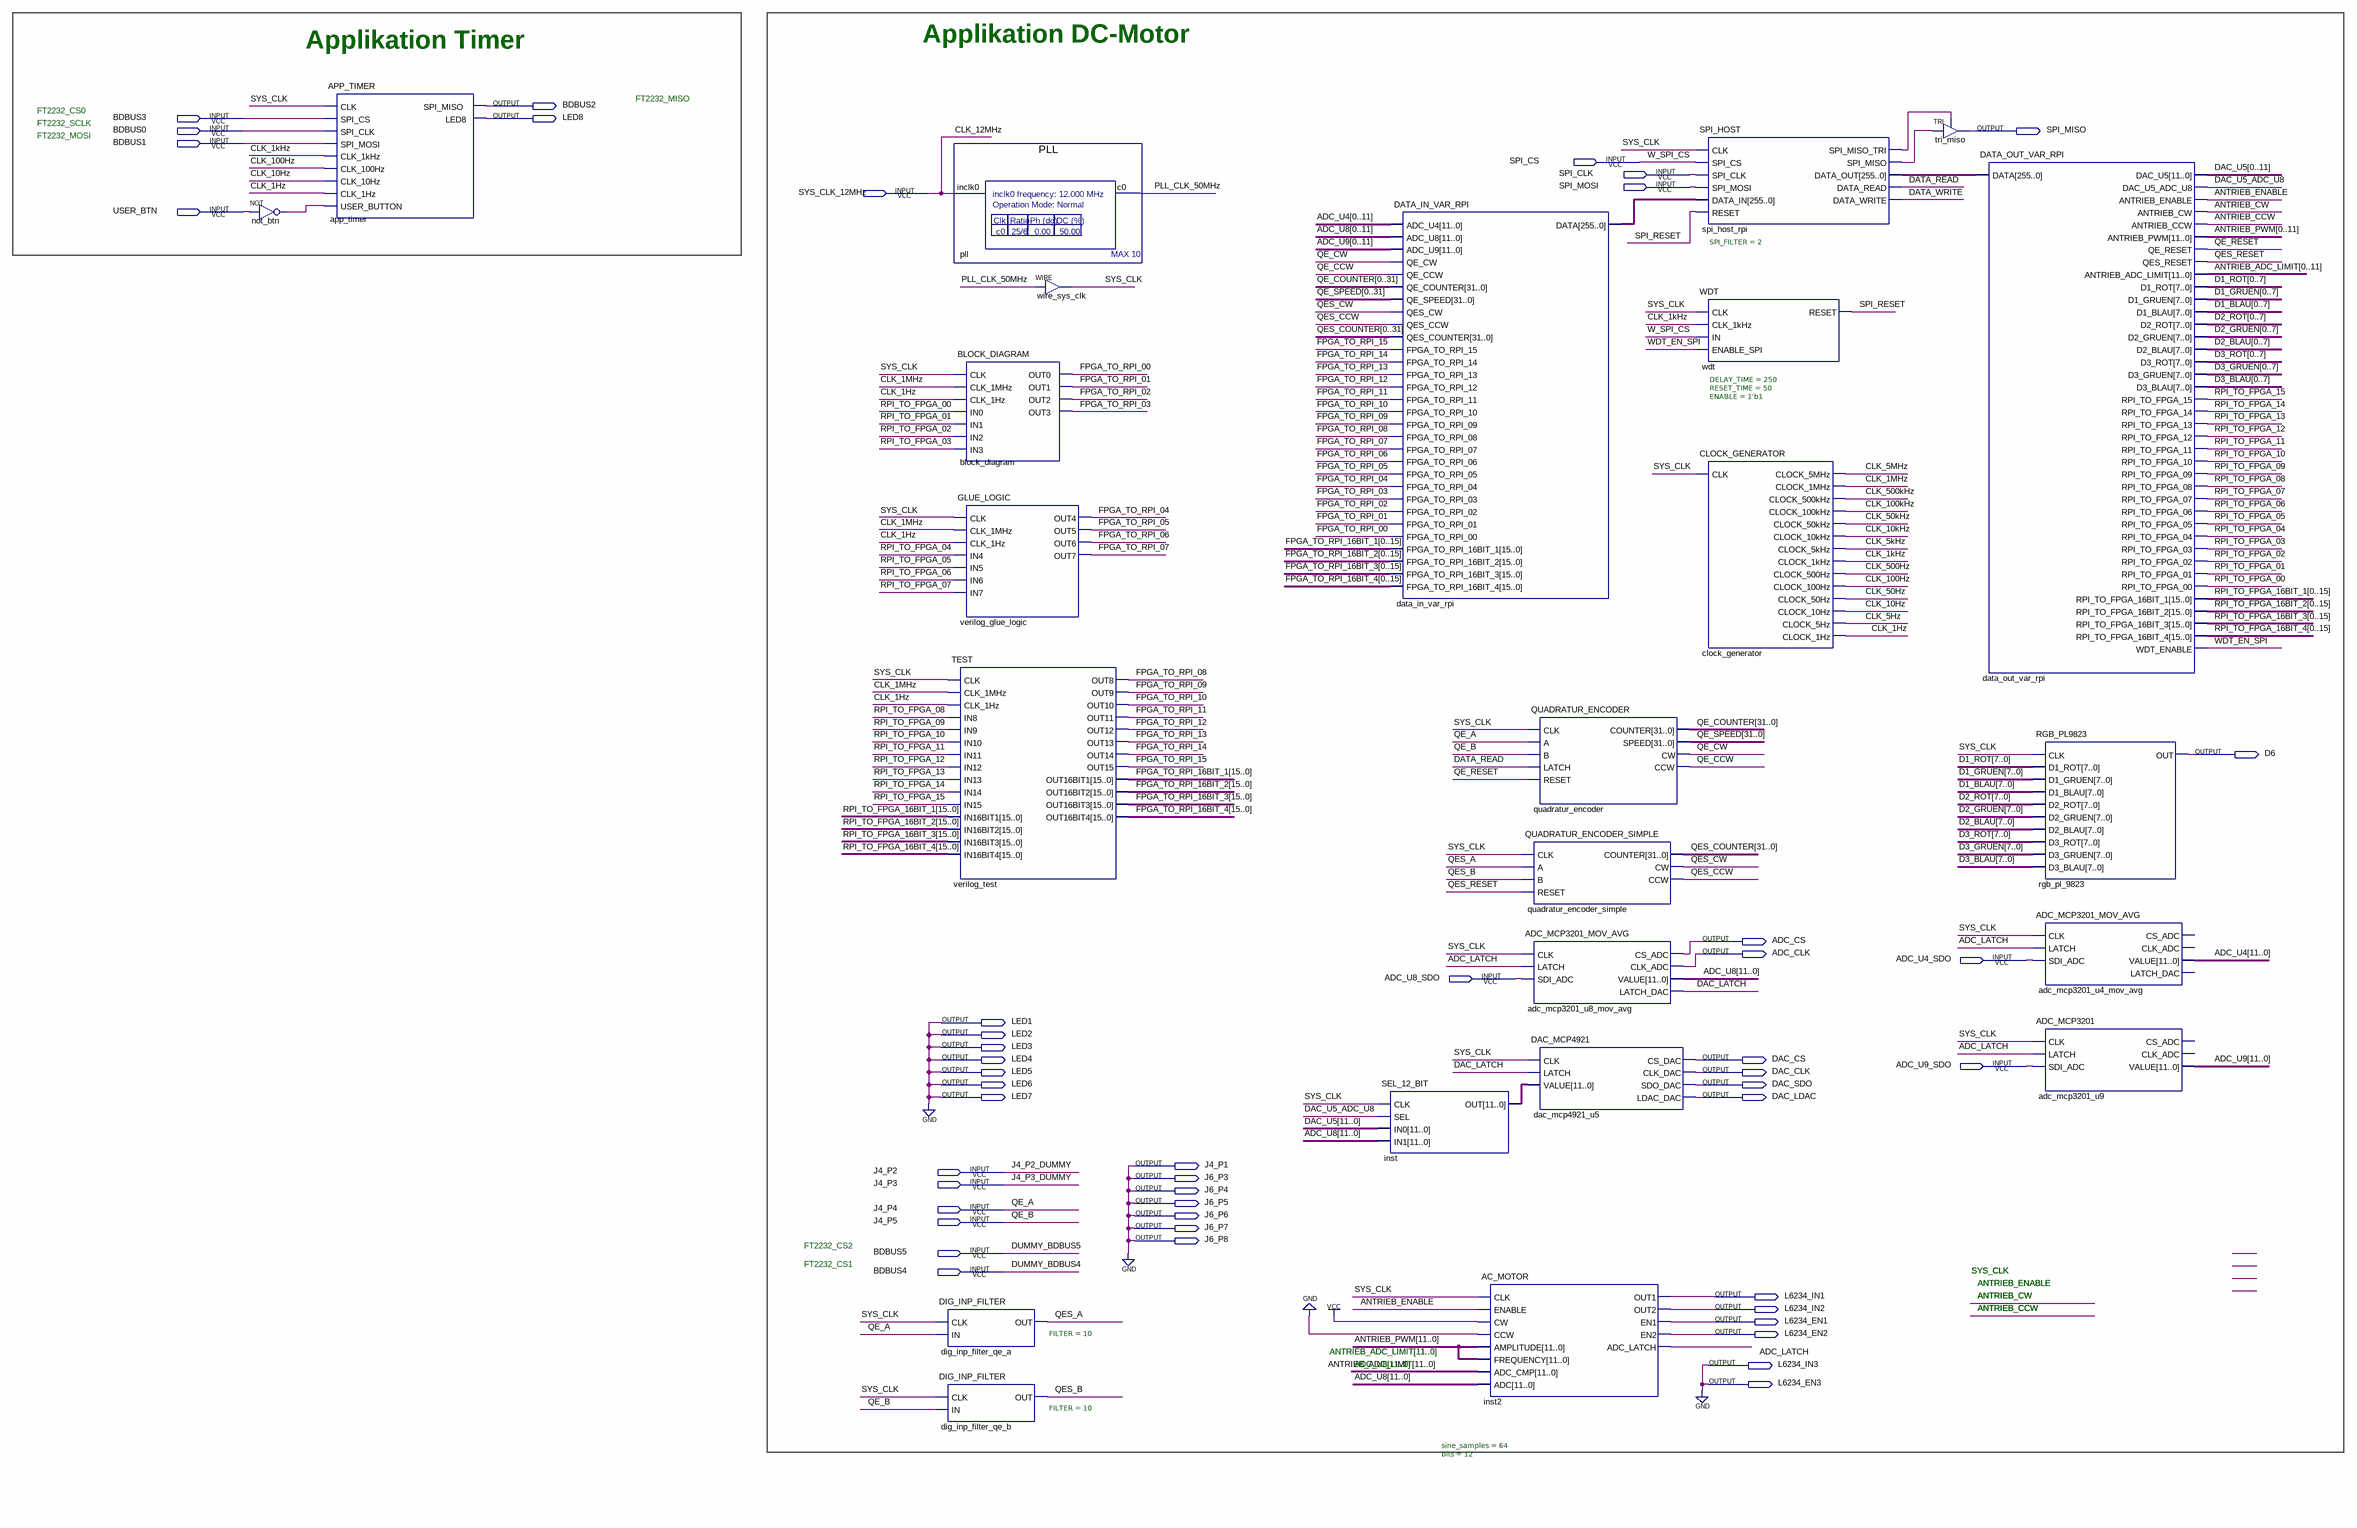
[diagram p0: schematic sheet]
// Quartus schematic MAX1000.bdf as structural Verilog: 24 symbols, 47 pins
module MAX1000 (
  input  BDBUS3,
  input  BDBUS0,
  input  BDBUS1,
  input  SPI_CS,
  input  SPI_CLK,
  input  SPI_MOSI,
  input  SYS_CLK_12MHz,
  input  USER_BTN,
  input  ADC_U4_SDO,
  input  ADC_U8_SDO,
  input  ADC_U9_SDO,
  input  J4_P2,
  input  J4_P3,
  input  J4_P4,
  input  J4_P5,
  input  BDBUS5,
  input  BDBUS4,
  output BDBUS2,
  output LED8,
  output SPI_MISO,
  output D6,
  output ADC_CS,
  output ADC_CLK,
  output LED1,
  output LED2,
  output LED3,
  output LED4,
  output DAC_CS,
  output LED5,
  output DAC_CLK,
  output LED6,
  output DAC_SDO,
  output LED7,
  output DAC_LDAC,
  output J4_P1,
  output J6_P3,
  output J6_P4,
  output J6_P5,
  output J6_P6,
  output J6_P7,
  output J6_P8,
  output L6234_IN1,
  output L6234_IN2,
  output L6234_EN1,
  output L6234_EN2,
  output L6234_IN3,
  output L6234_EN3
);

  wire ADC_LATCH, ANTRIEB_CCW, ANTRIEB_CW, ANTRIEB_ENABLE, CLK_1Hz, CLK_1kHz, CLK_1MHz, CLK_5Hz, CLK_5kHz,
       CLK_5MHz, CLK_10Hz, CLK_10kHz, CLK_50Hz, CLK_50kHz, CLK_100Hz, CLK_100kHz, CLK_500Hz, CLK_500kHz,
       DAC_LATCH, DAC_U5_ADC_U8, DATA_READ, DATA_WRITE, FPGA_TO_RPI_00, FPGA_TO_RPI_01, FPGA_TO_RPI_02,
       FPGA_TO_RPI_03, FPGA_TO_RPI_04, FPGA_TO_RPI_05, FPGA_TO_RPI_06, FPGA_TO_RPI_07, FPGA_TO_RPI_08,
       FPGA_TO_RPI_09, FPGA_TO_RPI_10, FPGA_TO_RPI_11, FPGA_TO_RPI_12, FPGA_TO_RPI_13, FPGA_TO_RPI_14,
       FPGA_TO_RPI_15, not_btn_out, PLL_CLK_50MHz, QE_CCW, QE_CW, QE_RESET, QES_A, QES_B, QES_CCW, QES_CW,
       QES_RESET, RPI_TO_FPGA_00, RPI_TO_FPGA_01, RPI_TO_FPGA_02, RPI_TO_FPGA_03, RPI_TO_FPGA_04,
       RPI_TO_FPGA_05, RPI_TO_FPGA_06, RPI_TO_FPGA_07, RPI_TO_FPGA_08, RPI_TO_FPGA_09, RPI_TO_FPGA_10,
       RPI_TO_FPGA_11, RPI_TO_FPGA_12, RPI_TO_FPGA_13, RPI_TO_FPGA_14, RPI_TO_FPGA_15, spi_host_rpi_spi_miso,
       spi_host_rpi_spi_miso_tri, SPI_RESET, SYS_CLK, WDT_EN_SPI;
  wire [7:0] D1_BLAU, D1_GRUEN, D1_ROT, D2_BLAU, D2_GRUEN, D2_ROT, D3_BLAU, D3_GRUEN, D3_ROT;
  wire [11:0] ADC_U4, ADC_U8, ADC_U9, ANTRIEB_ADC_LIMIT, ANTRIEB_PWM, DAC_U5, inst_out;
  wire [15:0] FPGA_TO_RPI_16BIT_1, FPGA_TO_RPI_16BIT_2, FPGA_TO_RPI_16BIT_3, FPGA_TO_RPI_16BIT_4,
       RPI_TO_FPGA_16BIT_1, RPI_TO_FPGA_16BIT_2, RPI_TO_FPGA_16BIT_3, RPI_TO_FPGA_16BIT_4;
  wire [31:0] QE_COUNTER, QE_SPEED, QES_COUNTER;
  wire [255:0] data_in_var_rpi_data, spi_host_rpi_data_out;

  not not_btn (not_btn_out, USER_BTN);
  APP_TIMER app_timer (
    .CLK(SYS_CLK), .SPI_CS(BDBUS3), .SPI_CLK(BDBUS0), .SPI_MOSI(BDBUS1), .CLK_1kHz(CLK_1kHz),
    .CLK_100Hz(CLK_100Hz), .CLK_10Hz(CLK_10Hz), .CLK_1Hz(CLK_1Hz), .USER_BUTTON(not_btn_out),
    .SPI_MISO(BDBUS2), .LED8(LED8));
  PLL pll (.inclk0(SYS_CLK_12MHz), .c0(PLL_CLK_50MHz));
  BLOCK_DIAGRAM block_diagram (
    .CLK(SYS_CLK), .CLK_1MHz(CLK_1MHz), .CLK_1Hz(CLK_1Hz), .IN0(RPI_TO_FPGA_00), .IN1(RPI_TO_FPGA_01),
    .IN2(RPI_TO_FPGA_02), .IN3(RPI_TO_FPGA_03), .OUT0(FPGA_TO_RPI_00), .OUT1(FPGA_TO_RPI_01),
    .OUT2(FPGA_TO_RPI_02), .OUT3(FPGA_TO_RPI_03));
  GLUE_LOGIC verilog_glue_logic (
    .CLK(SYS_CLK), .CLK_1MHz(CLK_1MHz), .CLK_1Hz(CLK_1Hz), .IN4(RPI_TO_FPGA_04), .IN5(RPI_TO_FPGA_05),
    .IN6(RPI_TO_FPGA_06), .IN7(RPI_TO_FPGA_07), .OUT4(FPGA_TO_RPI_04), .OUT5(FPGA_TO_RPI_05),
    .OUT6(FPGA_TO_RPI_06), .OUT7(FPGA_TO_RPI_07));
  TEST verilog_test (
    .CLK(SYS_CLK), .CLK_1MHz(CLK_1MHz), .CLK_1Hz(CLK_1Hz), .IN8(RPI_TO_FPGA_08), .IN9(RPI_TO_FPGA_09),
    .IN10(RPI_TO_FPGA_10), .IN11(RPI_TO_FPGA_11), .IN12(RPI_TO_FPGA_12), .IN13(RPI_TO_FPGA_13),
    .IN14(RPI_TO_FPGA_14), .IN15(RPI_TO_FPGA_15), .IN16BIT1(RPI_TO_FPGA_16BIT_1),
    .IN16BIT2(RPI_TO_FPGA_16BIT_2), .IN16BIT3(RPI_TO_FPGA_16BIT_3), .IN16BIT4(RPI_TO_FPGA_16BIT_4),
    .OUT8(FPGA_TO_RPI_08), .OUT9(FPGA_TO_RPI_09), .OUT10(FPGA_TO_RPI_10), .OUT11(FPGA_TO_RPI_11),
    .OUT12(FPGA_TO_RPI_12), .OUT13(FPGA_TO_RPI_13), .OUT14(FPGA_TO_RPI_14), .OUT15(FPGA_TO_RPI_15),
    .OUT16BIT1(FPGA_TO_RPI_16BIT_1), .OUT16BIT2(FPGA_TO_RPI_16BIT_2), .OUT16BIT3(FPGA_TO_RPI_16BIT_3),
    .OUT16BIT4(FPGA_TO_RPI_16BIT_4));
  DIG_INP_FILTER #(.FILTER(10)) dig_inp_filter_qe_a (.CLK(SYS_CLK), .IN(J4_P4), .OUT(QES_A));
  DIG_INP_FILTER #(.FILTER(10)) dig_inp_filter_qe_b (.CLK(SYS_CLK), .IN(J4_P5), .OUT(QES_B));
  assign SYS_CLK = PLL_CLK_50MHz;  // WIRE wire_sys_clk
  DATA_IN_VAR_RPI data_in_var_rpi (
    .ADC_U4({ADC_U4[0], ADC_U4[1], ADC_U4[2], ADC_U4[3], ADC_U4[4], ADC_U4[5], ADC_U4[6], ADC_U4[7], ADC_U4[8], ADC_U4[9], ADC_U4[10], ADC_U4[11]}),
    .ADC_U8({ADC_U8[0], ADC_U8[1], ADC_U8[2], ADC_U8[3], ADC_U8[4], ADC_U8[5], ADC_U8[6], ADC_U8[7], ADC_U8[8], ADC_U8[9], ADC_U8[10], ADC_U8[11]}),
    .ADC_U9({ADC_U9[0], ADC_U9[1], ADC_U9[2], ADC_U9[3], ADC_U9[4], ADC_U9[5], ADC_U9[6], ADC_U9[7], ADC_U9[8], ADC_U9[9], ADC_U9[10], ADC_U9[11]}),
    .QE_CW(QE_CW), .QE_CCW(QE_CCW),
    .QE_COUNTER({QE_COUNTER[0], QE_COUNTER[1], QE_COUNTER[2], QE_COUNTER[3], QE_COUNTER[4], QE_COUNTER[5], QE_COUNTER[6], QE_COUNTER[7], QE_COUNTER[8], QE_COUNTER[9], QE_COUNTER[10], QE_COUNTER[11], QE_COUNTER[12], QE_COUNTER[13], QE_COUNTER[14], QE_COUNTER[15], QE_COUNTER[16], QE_COUNTER[17], QE_COUNTER[18], QE_COUNTER[19], QE_COUNTER[20], QE_COUNTER[21], QE_COUNTER[22], QE_COUNTER[23], QE_COUNTER[24], QE_COUNTER[25], QE_COUNTER[26], QE_COUNTER[27], QE_COUNTER[28], QE_COUNTER[29], QE_COUNTER[30], QE_COUNTER[31]}),
    .QE_SPEED({QE_SPEED[0], QE_SPEED[1], QE_SPEED[2], QE_SPEED[3], QE_SPEED[4], QE_SPEED[5], QE_SPEED[6], QE_SPEED[7], QE_SPEED[8], QE_SPEED[9], QE_SPEED[10], QE_SPEED[11], QE_SPEED[12], QE_SPEED[13], QE_SPEED[14], QE_SPEED[15], QE_SPEED[16], QE_SPEED[17], QE_SPEED[18], QE_SPEED[19], QE_SPEED[20], QE_SPEED[21], QE_SPEED[22], QE_SPEED[23], QE_SPEED[24], QE_SPEED[25], QE_SPEED[26], QE_SPEED[27], QE_SPEED[28], QE_SPEED[29], QE_SPEED[30], QE_SPEED[31]}),
    .QES_CW(QES_CW), .QES_CCW(QES_CCW),
    .QES_COUNTER({QES_COUNTER[0], QES_COUNTER[1], QES_COUNTER[2], QES_COUNTER[3], QES_COUNTER[4], QES_COUNTER[5], QES_COUNTER[6], QES_COUNTER[7], QES_COUNTER[8], QES_COUNTER[9], QES_COUNTER[10], QES_COUNTER[11], QES_COUNTER[12], QES_COUNTER[13], QES_COUNTER[14], QES_COUNTER[15], QES_COUNTER[16], QES_COUNTER[17], QES_COUNTER[18], QES_COUNTER[19], QES_COUNTER[20], QES_COUNTER[21], QES_COUNTER[22], QES_COUNTER[23], QES_COUNTER[24], QES_COUNTER[25], QES_COUNTER[26], QES_COUNTER[27], QES_COUNTER[28], QES_COUNTER[29], QES_COUNTER[30], QES_COUNTER[31]}),
    .FPGA_TO_RPI_15(FPGA_TO_RPI_15), .FPGA_TO_RPI_14(FPGA_TO_RPI_14), .FPGA_TO_RPI_13(FPGA_TO_RPI_13),
    .FPGA_TO_RPI_12(FPGA_TO_RPI_12), .FPGA_TO_RPI_11(FPGA_TO_RPI_11), .FPGA_TO_RPI_10(FPGA_TO_RPI_10),
    .FPGA_TO_RPI_09(FPGA_TO_RPI_09), .FPGA_TO_RPI_08(FPGA_TO_RPI_08), .FPGA_TO_RPI_07(FPGA_TO_RPI_07),
    .FPGA_TO_RPI_06(FPGA_TO_RPI_06), .FPGA_TO_RPI_05(FPGA_TO_RPI_05), .FPGA_TO_RPI_04(FPGA_TO_RPI_04),
    .FPGA_TO_RPI_03(FPGA_TO_RPI_03), .FPGA_TO_RPI_02(FPGA_TO_RPI_02), .FPGA_TO_RPI_01(FPGA_TO_RPI_01),
    .FPGA_TO_RPI_00(FPGA_TO_RPI_00),
    .FPGA_TO_RPI_16BIT_1({FPGA_TO_RPI_16BIT_1[0], FPGA_TO_RPI_16BIT_1[1], FPGA_TO_RPI_16BIT_1[2], FPGA_TO_RPI_16BIT_1[3], FPGA_TO_RPI_16BIT_1[4], FPGA_TO_RPI_16BIT_1[5], FPGA_TO_RPI_16BIT_1[6], FPGA_TO_RPI_16BIT_1[7], FPGA_TO_RPI_16BIT_1[8], FPGA_TO_RPI_16BIT_1[9], FPGA_TO_RPI_16BIT_1[10], FPGA_TO_RPI_16BIT_1[11], FPGA_TO_RPI_16BIT_1[12], FPGA_TO_RPI_16BIT_1[13], FPGA_TO_RPI_16BIT_1[14], FPGA_TO_RPI_16BIT_1[15]}),
    .FPGA_TO_RPI_16BIT_2({FPGA_TO_RPI_16BIT_2[0], FPGA_TO_RPI_16BIT_2[1], FPGA_TO_RPI_16BIT_2[2], FPGA_TO_RPI_16BIT_2[3], FPGA_TO_RPI_16BIT_2[4], FPGA_TO_RPI_16BIT_2[5], FPGA_TO_RPI_16BIT_2[6], FPGA_TO_RPI_16BIT_2[7], FPGA_TO_RPI_16BIT_2[8], FPGA_TO_RPI_16BIT_2[9], FPGA_TO_RPI_16BIT_2[10], FPGA_TO_RPI_16BIT_2[11], FPGA_TO_RPI_16BIT_2[12], FPGA_TO_RPI_16BIT_2[13], FPGA_TO_RPI_16BIT_2[14], FPGA_TO_RPI_16BIT_2[15]}),
    .FPGA_TO_RPI_16BIT_3({FPGA_TO_RPI_16BIT_3[0], FPGA_TO_RPI_16BIT_3[1], FPGA_TO_RPI_16BIT_3[2], FPGA_TO_RPI_16BIT_3[3], FPGA_TO_RPI_16BIT_3[4], FPGA_TO_RPI_16BIT_3[5], FPGA_TO_RPI_16BIT_3[6], FPGA_TO_RPI_16BIT_3[7], FPGA_TO_RPI_16BIT_3[8], FPGA_TO_RPI_16BIT_3[9], FPGA_TO_RPI_16BIT_3[10], FPGA_TO_RPI_16BIT_3[11], FPGA_TO_RPI_16BIT_3[12], FPGA_TO_RPI_16BIT_3[13], FPGA_TO_RPI_16BIT_3[14], FPGA_TO_RPI_16BIT_3[15]}),
    .FPGA_TO_RPI_16BIT_4({FPGA_TO_RPI_16BIT_4[0], FPGA_TO_RPI_16BIT_4[1], FPGA_TO_RPI_16BIT_4[2], FPGA_TO_RPI_16BIT_4[3], FPGA_TO_RPI_16BIT_4[4], FPGA_TO_RPI_16BIT_4[5], FPGA_TO_RPI_16BIT_4[6], FPGA_TO_RPI_16BIT_4[7], FPGA_TO_RPI_16BIT_4[8], FPGA_TO_RPI_16BIT_4[9], FPGA_TO_RPI_16BIT_4[10], FPGA_TO_RPI_16BIT_4[11], FPGA_TO_RPI_16BIT_4[12], FPGA_TO_RPI_16BIT_4[13], FPGA_TO_RPI_16BIT_4[14], FPGA_TO_RPI_16BIT_4[15]}),
    .DATA(data_in_var_rpi_data));
  SEL_12_BIT inst (.CLK(SYS_CLK), .SEL(DAC_U5_ADC_U8), .IN0(DAC_U5), .IN1(ADC_U8), .OUT(inst_out));
  AC_MOTOR #(.sine_samples(64), .bits(12)) inst2 (
    .CLK(SYS_CLK), .ENABLE(ANTRIEB_ENABLE), .CW(1'b1), .CCW(1'b0), .AMPLITUDE(ANTRIEB_PWM),
    .FREQUENCY(ANTRIEB_PWM), .ADC_CMP(ANTRIEB_ADC_LIMIT), .ADC(ADC_U8), .OUT1(L6234_IN1), .OUT2(L6234_IN2),
    .EN1(L6234_EN1), .EN2(L6234_EN2), .ADC_LATCH(ADC_LATCH));
  QUADRATUR_ENCODER quadratur_encoder (
    .CLK(SYS_CLK), .A(J4_P4), .B(J4_P5), .LATCH(DATA_READ), .RESET(QE_RESET), .COUNTER(QE_COUNTER),
    .SPEED(QE_SPEED), .CW(QE_CW), .CCW(QE_CCW));
  QUADRATUR_ENCODER_SIMPLE quadratur_encoder_simple (
    .CLK(SYS_CLK), .A(QES_A), .B(QES_B), .RESET(QES_RESET), .COUNTER(QES_COUNTER), .CW(QES_CW), .CCW(QES_CCW));
  ADC_MCP3201_MOV_AVG adc_mcp3201_u8_mov_avg (
    .CLK(SYS_CLK), .LATCH(ADC_LATCH), .SDI_ADC(ADC_U8_SDO), .CS_ADC(ADC_CS), .CLK_ADC(ADC_CLK),
    .VALUE(ADC_U8), .LATCH_DAC(DAC_LATCH));
  DAC_MCP4921 dac_mcp4921_u5 (
    .CLK(SYS_CLK), .LATCH(DAC_LATCH), .VALUE(inst_out), .CS_DAC(DAC_CS), .CLK_DAC(DAC_CLK),
    .SDO_DAC(DAC_SDO), .LDAC_DAC(DAC_LDAC));
  SPI_HOST #(.SPI_FILTER(2)) spi_host_rpi (
    .CLK(SYS_CLK), .SPI_CS(SPI_CS), .SPI_CLK(SPI_CLK), .SPI_MOSI(SPI_MOSI), .DATA_IN(data_in_var_rpi_data),
    .RESET(SPI_RESET), .SPI_MISO_TRI(spi_host_rpi_spi_miso_tri), .SPI_MISO(spi_host_rpi_spi_miso),
    .DATA_OUT(spi_host_rpi_data_out), .DATA_READ(DATA_READ), .DATA_WRITE(DATA_WRITE));
  WDT #(.DELAY_TIME(250), .RESET_TIME(50), .ENABLE(1'b1)) wdt (
    .CLK(SYS_CLK), .CLK_1kHz(CLK_1kHz), .IN(SPI_CS), .ENABLE_SPI(WDT_EN_SPI), .RESET(SPI_RESET));
  CLOCK_GENERATOR clock_generator (
    .CLK(SYS_CLK), .CLOCK_5MHz(CLK_5MHz), .CLOCK_1MHz(CLK_1MHz), .CLOCK_500kHz(CLK_500kHz),
    .CLOCK_100kHz(CLK_100kHz), .CLOCK_50kHz(CLK_50kHz), .CLOCK_10kHz(CLK_10kHz), .CLOCK_5kHz(CLK_5kHz),
    .CLOCK_1kHz(CLK_1kHz), .CLOCK_500Hz(CLK_500Hz), .CLOCK_100Hz(CLK_100Hz), .CLOCK_50Hz(CLK_50Hz),
    .CLOCK_10Hz(CLK_10Hz), .CLOCK_5Hz(CLK_5Hz), .CLOCK_1Hz(CLK_1Hz));
  TRI tri_miso (.IN(spi_host_rpi_spi_miso), .OE(spi_host_rpi_spi_miso_tri), .OUT(SPI_MISO));
  DATA_OUT_VAR_RPI data_out_var_rpi (
    .DATA(spi_host_rpi_data_out),
    .DAC_U5({DAC_U5[0], DAC_U5[1], DAC_U5[2], DAC_U5[3], DAC_U5[4], DAC_U5[5], DAC_U5[6], DAC_U5[7], DAC_U5[8], DAC_U5[9], DAC_U5[10], DAC_U5[11]}),
    .DAC_U5_ADC_U8(DAC_U5_ADC_U8), .ANTRIEB_ENABLE(ANTRIEB_ENABLE), .ANTRIEB_CW(ANTRIEB_CW),
    .ANTRIEB_CCW(ANTRIEB_CCW),
    .ANTRIEB_PWM({ANTRIEB_PWM[0], ANTRIEB_PWM[1], ANTRIEB_PWM[2], ANTRIEB_PWM[3], ANTRIEB_PWM[4], ANTRIEB_PWM[5], ANTRIEB_PWM[6], ANTRIEB_PWM[7], ANTRIEB_PWM[8], ANTRIEB_PWM[9], ANTRIEB_PWM[10], ANTRIEB_PWM[11]}),
    .QE_RESET(QE_RESET), .QES_RESET(QES_RESET),
    .ANTRIEB_ADC_LIMIT({ANTRIEB_ADC_LIMIT[0], ANTRIEB_ADC_LIMIT[1], ANTRIEB_ADC_LIMIT[2], ANTRIEB_ADC_LIMIT[3], ANTRIEB_ADC_LIMIT[4], ANTRIEB_ADC_LIMIT[5], ANTRIEB_ADC_LIMIT[6], ANTRIEB_ADC_LIMIT[7], ANTRIEB_ADC_LIMIT[8], ANTRIEB_ADC_LIMIT[9], ANTRIEB_ADC_LIMIT[10], ANTRIEB_ADC_LIMIT[11]}),
    .D1_ROT({D1_ROT[0], D1_ROT[1], D1_ROT[2], D1_ROT[3], D1_ROT[4], D1_ROT[5], D1_ROT[6], D1_ROT[7]}),
    .D1_GRUEN({D1_GRUEN[0], D1_GRUEN[1], D1_GRUEN[2], D1_GRUEN[3], D1_GRUEN[4], D1_GRUEN[5], D1_GRUEN[6], D1_GRUEN[7]}),
    .D1_BLAU({D1_BLAU[0], D1_BLAU[1], D1_BLAU[2], D1_BLAU[3], D1_BLAU[4], D1_BLAU[5], D1_BLAU[6], D1_BLAU[7]}),
    .D2_ROT({D2_ROT[0], D2_ROT[1], D2_ROT[2], D2_ROT[3], D2_ROT[4], D2_ROT[5], D2_ROT[6], D2_ROT[7]}),
    .D2_GRUEN({D2_GRUEN[0], D2_GRUEN[1], D2_GRUEN[2], D2_GRUEN[3], D2_GRUEN[4], D2_GRUEN[5], D2_GRUEN[6], D2_GRUEN[7]}),
    .D2_BLAU({D2_BLAU[0], D2_BLAU[1], D2_BLAU[2], D2_BLAU[3], D2_BLAU[4], D2_BLAU[5], D2_BLAU[6], D2_BLAU[7]}),
    .D3_ROT({D3_ROT[0], D3_ROT[1], D3_ROT[2], D3_ROT[3], D3_ROT[4], D3_ROT[5], D3_ROT[6], D3_ROT[7]}),
    .D3_GRUEN({D3_GRUEN[0], D3_GRUEN[1], D3_GRUEN[2], D3_GRUEN[3], D3_GRUEN[4], D3_GRUEN[5], D3_GRUEN[6], D3_GRUEN[7]}),
    .D3_BLAU({D3_BLAU[0], D3_BLAU[1], D3_BLAU[2], D3_BLAU[3], D3_BLAU[4], D3_BLAU[5], D3_BLAU[6], D3_BLAU[7]}),
    .RPI_TO_FPGA_15(RPI_TO_FPGA_15), .RPI_TO_FPGA_14(RPI_TO_FPGA_14), .RPI_TO_FPGA_13(RPI_TO_FPGA_13),
    .RPI_TO_FPGA_12(RPI_TO_FPGA_12), .RPI_TO_FPGA_11(RPI_TO_FPGA_11), .RPI_TO_FPGA_10(RPI_TO_FPGA_10),
    .RPI_TO_FPGA_09(RPI_TO_FPGA_09), .RPI_TO_FPGA_08(RPI_TO_FPGA_08), .RPI_TO_FPGA_07(RPI_TO_FPGA_07),
    .RPI_TO_FPGA_06(RPI_TO_FPGA_06), .RPI_TO_FPGA_05(RPI_TO_FPGA_05), .RPI_TO_FPGA_04(RPI_TO_FPGA_04),
    .RPI_TO_FPGA_03(RPI_TO_FPGA_03), .RPI_TO_FPGA_02(RPI_TO_FPGA_02), .RPI_TO_FPGA_01(RPI_TO_FPGA_01),
    .RPI_TO_FPGA_00(RPI_TO_FPGA_00),
    .RPI_TO_FPGA_16BIT_1({RPI_TO_FPGA_16BIT_1[0], RPI_TO_FPGA_16BIT_1[1], RPI_TO_FPGA_16BIT_1[2], RPI_TO_FPGA_16BIT_1[3], RPI_TO_FPGA_16BIT_1[4], RPI_TO_FPGA_16BIT_1[5], RPI_TO_FPGA_16BIT_1[6], RPI_TO_FPGA_16BIT_1[7], RPI_TO_FPGA_16BIT_1[8], RPI_TO_FPGA_16BIT_1[9], RPI_TO_FPGA_16BIT_1[10], RPI_TO_FPGA_16BIT_1[11], RPI_TO_FPGA_16BIT_1[12], RPI_TO_FPGA_16BIT_1[13], RPI_TO_FPGA_16BIT_1[14], RPI_TO_FPGA_16BIT_1[15]}),
    .RPI_TO_FPGA_16BIT_2({RPI_TO_FPGA_16BIT_2[0], RPI_TO_FPGA_16BIT_2[1], RPI_TO_FPGA_16BIT_2[2], RPI_TO_FPGA_16BIT_2[3], RPI_TO_FPGA_16BIT_2[4], RPI_TO_FPGA_16BIT_2[5], RPI_TO_FPGA_16BIT_2[6], RPI_TO_FPGA_16BIT_2[7], RPI_TO_FPGA_16BIT_2[8], RPI_TO_FPGA_16BIT_2[9], RPI_TO_FPGA_16BIT_2[10], RPI_TO_FPGA_16BIT_2[11], RPI_TO_FPGA_16BIT_2[12], RPI_TO_FPGA_16BIT_2[13], RPI_TO_FPGA_16BIT_2[14], RPI_TO_FPGA_16BIT_2[15]}),
    .RPI_TO_FPGA_16BIT_3({RPI_TO_FPGA_16BIT_3[0], RPI_TO_FPGA_16BIT_3[1], RPI_TO_FPGA_16BIT_3[2], RPI_TO_FPGA_16BIT_3[3], RPI_TO_FPGA_16BIT_3[4], RPI_TO_FPGA_16BIT_3[5], RPI_TO_FPGA_16BIT_3[6], RPI_TO_FPGA_16BIT_3[7], RPI_TO_FPGA_16BIT_3[8], RPI_TO_FPGA_16BIT_3[9], RPI_TO_FPGA_16BIT_3[10], RPI_TO_FPGA_16BIT_3[11], RPI_TO_FPGA_16BIT_3[12], RPI_TO_FPGA_16BIT_3[13], RPI_TO_FPGA_16BIT_3[14], RPI_TO_FPGA_16BIT_3[15]}),
    .RPI_TO_FPGA_16BIT_4({RPI_TO_FPGA_16BIT_4[0], RPI_TO_FPGA_16BIT_4[1], RPI_TO_FPGA_16BIT_4[2], RPI_TO_FPGA_16BIT_4[3], RPI_TO_FPGA_16BIT_4[4], RPI_TO_FPGA_16BIT_4[5], RPI_TO_FPGA_16BIT_4[6], RPI_TO_FPGA_16BIT_4[7], RPI_TO_FPGA_16BIT_4[8], RPI_TO_FPGA_16BIT_4[9], RPI_TO_FPGA_16BIT_4[10], RPI_TO_FPGA_16BIT_4[11], RPI_TO_FPGA_16BIT_4[12], RPI_TO_FPGA_16BIT_4[13], RPI_TO_FPGA_16BIT_4[14], RPI_TO_FPGA_16BIT_4[15]}),
    .WDT_ENABLE(WDT_EN_SPI));
  RGB_PL9823 rgb_pl_9823 (
    .CLK(SYS_CLK), .D1_ROT(D1_ROT), .D1_GRUEN(D1_GRUEN), .D1_BLAU(D1_BLAU), .D2_ROT(D2_ROT),
    .D2_GRUEN(D2_GRUEN), .D2_BLAU(D2_BLAU), .D3_ROT(D3_ROT), .D3_GRUEN(D3_GRUEN), .D3_BLAU(D3_BLAU), .OUT(D6));
  ADC_MCP3201_MOV_AVG adc_mcp3201_u4_mov_avg (
    .CLK(SYS_CLK), .LATCH(ADC_LATCH), .SDI_ADC(ADC_U4_SDO), .VALUE(ADC_U4));  // open: CS_ADC, CLK_ADC, LATCH_DAC
  ADC_MCP3201 adc_mcp3201_u9 (
    .CLK(SYS_CLK), .LATCH(ADC_LATCH), .SDI_ADC(ADC_U9_SDO), .VALUE(ADC_U9));  // open: CS_ADC, CLK_ADC

  assign J4_P1 = 1'b0;
  assign J6_P3 = 1'b0;
  assign J6_P4 = 1'b0;
  assign J6_P5 = 1'b0;
  assign J6_P6 = 1'b0;
  assign J6_P7 = 1'b0;
  assign J6_P8 = 1'b0;
  assign L6234_EN3 = 1'b0;
  assign L6234_IN3 = 1'b0;
  assign LED1 = 1'b0;
  assign LED2 = 1'b0;
  assign LED3 = 1'b0;
  assign LED4 = 1'b0;
  assign LED5 = 1'b0;
  assign LED6 = 1'b0;
  assign LED7 = 1'b0;

  // Other names for the same wires on the sheet: DUMMY_BDBUS4 = BDBUS4; DUMMY_BDBUS5 = BDBUS5; J4_P2_DUMMY = J4_P2;
  //   J4_P3_DUMMY = J4_P3; QE_A = J4_P4; QE_B = J4_P5; CLK_12MHz = SYS_CLK_12MHz; W_SPI_CS = SPI_CS

  // Notes on the sheet:
  //   Applikation DC-Motor
  //   Applikation Timer
  //   FT2232_MISO
  //   FT2232_CS0
  //   FT2232_SCLK
  //   FT2232_MOSI
  //   FT2232_CS2
  //   FT2232_CS1
  //   SYS_CLK
  //   SYS_CLK
  //   SYS_CLK
  //   ANTRIEB_ENABLE
  //   ANTRIEB_ENABLE
  //   ANTRIEB_ENABLE
  //   ANTRIEB_CW
  //   ANTRIEB_CW
  //   ANTRIEB_CW
  //   ANTRIEB_CCW
  //   ANTRIEB_CCW
  //   ANTRIEB_CCW
  //   ANTRIEB_ADC_LIMIT[11..0]
  //   ANTRIEB_ADC_LIMIT[11..0]
  //   ADC_U8[11..0]
  //   ADC_U8[11..0]
endmodule
